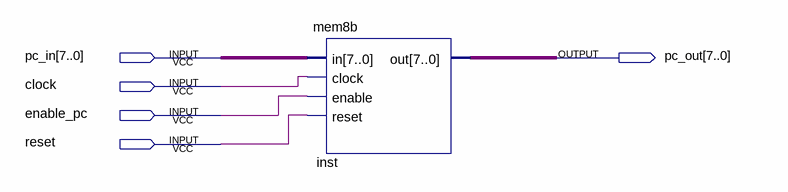
[diagram p0: schematic sheet]
// Quartus schematic pc.bdf as structural Verilog: 1 symbols, 5 pins
module pc (
  input  [7:0] pc_in,
  input  clock,
  input  enable_pc,
  input  reset,
  output [7:0] pc_out
);

  mem8b inst (.in(pc_in), .clock(clock), .enable(enable_pc), .reset(reset), .out(pc_out));
endmodule
